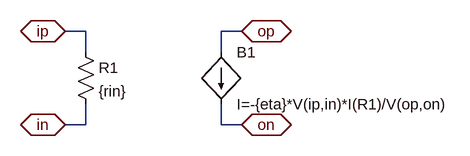
[diagram p0: schematic dcdcri.asc]
dcdcri.asc, the LTspice schematic file:
Version 4.1
SHEET 1 880 680
WIRE 80 112 48 112
WIRE 320 112 288 112
WIRE 80 144 80 112
WIRE 288 144 288 112
WIRE 80 256 80 224
WIRE 80 256 48 256
WIRE 288 256 288 224
WIRE 320 256 288 256
FLAG 48 112 ip
IOPIN 48 112 BiDir
FLAG 48 256 in
IOPIN 48 256 BiDir
FLAG 320 112 op
IOPIN 320 112 BiDir
FLAG 320 256 on
IOPIN 320 256 BiDir
SYMBOL res 64 128 R0
SYMATTR InstName R1
SYMATTR Value {rin}
SYMBOL bi 288 144 R0
SYMATTR InstName B1
SYMATTR Value I=-{eta}*V(ip,in)*I(R1)/V(op,on)

The netlist it stands for:
* dcdcri.asc
R1 ip in {rin}
B1 op on I=-{eta}*V(ip,in)*I(R1)/V(op,on)
.backanno
.end